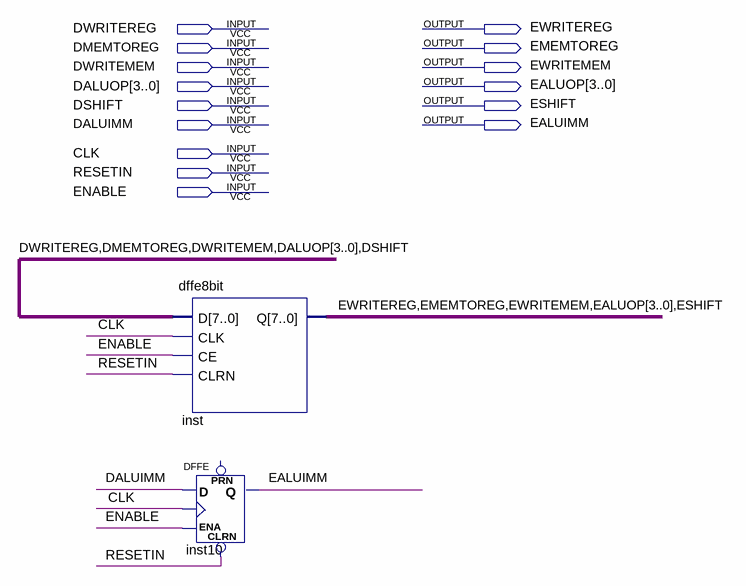
[diagram p0: schematic sheet]
// Quartus schematic ID-EXE-SIGNAL-BUFFER.bdf as structural Verilog: 2 symbols, 15 pins
module \ID-EXE-SIGNAL-BUFFER  (
  input  DWRITEREG,
  input  DMEMTOREG,
  input  DWRITEMEM,
  input  [3:0] DALUOP,
  input  DSHIFT,
  input  DALUIMM,
  input  CLK,
  input  RESETIN,
  input  ENABLE,
  output EWRITEREG,
  output EMEMTOREG,
  output EWRITEMEM,
  output [3:0] EALUOP,
  output ESHIFT,
  output EALUIMM
);

  dffe8bit inst (
    .D({DWRITEREG, DMEMTOREG, DWRITEMEM, DALUOP, DSHIFT}), .CLK(CLK), .CE(ENABLE), .CLRN(RESETIN),
    .Q({EWRITEREG, EMEMTOREG, EWRITEMEM, EALUOP, ESHIFT}));
  DFFE inst10 (.CLRN(RESETIN), .D(DALUIMM), .CLK(CLK), .ENA(ENABLE), .Q(EALUIMM));  // open: PRN
endmodule
